# EAGLE design MiiChrono (EAGLE 7.5.0)
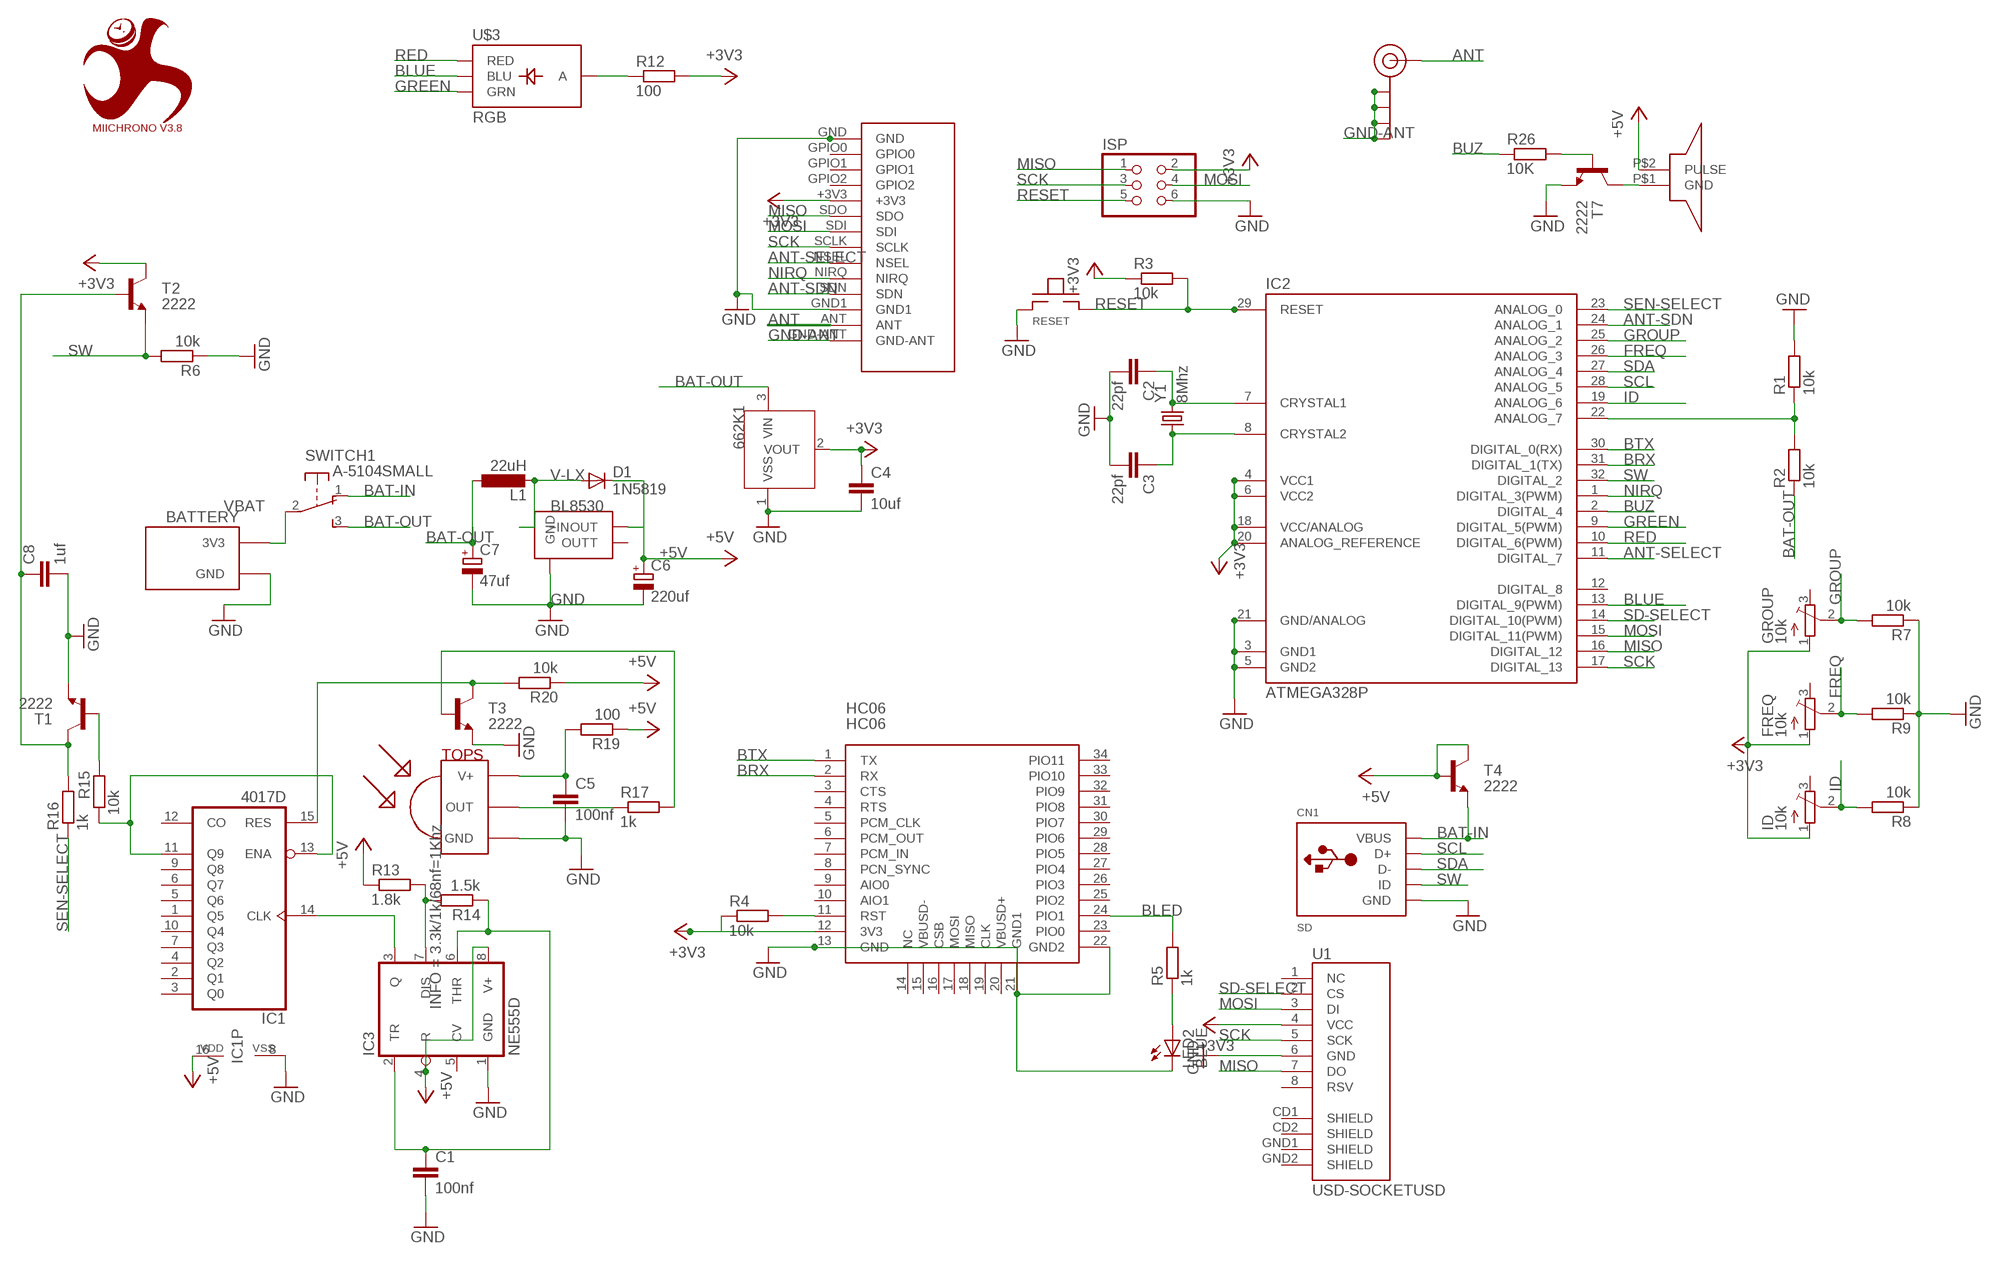
[diagram p0: schematic, sheet 1]

## Parts
662K1  XC6206  [SOT23]
BATTERY  GOPRO3BATTERY  [GOPRO3BATTERY]
BL8530  BL8530  [SOT89]
BUZZER  BUZZER  [BUZZER]
C1  100nf  C-EUC0805  [C0805]
C2  22pf  C-EUC0805  [C0805]
C3  22pf  C-EUC0805  [C0805]
C4  10uf  C-EUC0805  [C0805]
C5  100nf  C-EUC0805  [C0805]
C6  220uf  CPOL-EUCT3528  [CT3528]
C7  47uf  CPOL-EUSMCA  [SMC_A]
C8  1uf  C-EUC0805  [C0805]
CN1  SD  USBMINIB  [USB-MINIB]
D1  1N5819  DIODE-DO214AC  [DO214AC]
FREQ  10k  TRIMPOTTC33X  [TC33X]
GROUP  10k  TRIMPOTTC33X  [TC33X]
HC06  HC06  HC_05  [BLUETOOTH_SMD]
IC1  4017D  [SO16]
IC2  ATMEGA328P  ATMEGA168-AU  [TQFP32-08]
IC3  NE555D  [SO08]
ID  10k  TRIMPOTTC33X  [TC33X]
ISP  PINHD-2X03_2.00  [2X03M]
J$1  SMA_EDGE  [SMA-EDGE]
L1  22uH  L-EUL1812  [L1812]
LED2  BLUE  LEDCHIP-LED0805  [CHIP-LED0805]
R1  10k  R-EU_R0805  [R0805]
R2  10k  R-EU_R0805  [R0805]
R3  10k  R-EU_R0805  [R0805]
R4  10k  R-EU_R0805  [R0805]
R5  1k  R-EU_R0805  [R0805]
R6  10k  R-EU_R0805  [R0805]
R7  10k  R-EU_R0805  [R0805]
R8  10k  R-EU_R0805  [R0805]
R9  10k  R-EU_R0805  [R0805]
R12  100  R-EU_R0805  [R0805]
R13  1.8k  R-EU_R0805  [R0805]
R14  1.5k  R-EU_R0805  [R0805]
R15  10k  R-EU_R0805  [R0805]
R16  1k  R-EU_R0805  [R0805]
R17  1k  R-EU_R0805  [R0805]
R19  100  R-EU_R0805  [R0805]
R20  10k  R-EU_R0805  [R0805]
R26  10K  R-EU_R0805  [R0805]
RESET  TACT  [TACT-TS-1289]
SWITCH  A-5104SMALL  [A-5104-SMALL]
T1  2222  TRANSISTOR_NPNSOT23  [SOT23]
T2  2222  TRANSISTOR_NPNSOT23  [SOT23]
T3  2222  TRANSISTOR_NPNSOT23  [SOT23]
T4  2222  TRANSISTOR_NPNSOT23  [SOT23]
T7  2222  TRANSISTOR_NPNSOT23  [SOT23]
TOPS  TSOP4838  [TSOP18XX]
U1  USD-SOCKETUSD  [USD-SOCKET-PP]
U$1  MIICHRONO V3.8  MIICHRONO  [MIICHRONO]
U$3  RGB  LED-TRICOLOR  [LED-TRICOLOR-SMD]
U$7  SI4432  SPI4432  [SI4432]
Y1  8Mhz  CRYSTALSMD  [HC49UP]

## Nets
+3V3 [supply]: 662K1.2(VOUT) C4.1 FREQ.1(A) GROUP.1(A) HC06.12(3V3) IC2.4(VCC1) IC2.6(VCC2) IC2.18(VCC/ANALOG) IC2.20(ANALOG_REFERENCE) ID.1(A) ISP.2 R3.1 R4.1 R12.2 T2.3(C) U1.4(VCC) U$7.+3V3
+5V [supply]: BL8530.2(OUT) BUZZER.P$2(PULSE) C6.+ D1.C IC1.16(VDD) IC3.4(R) IC3.8(V+) R13.1 R19.1 R20.1 T4.1(B) T4.3(C)
ANT [antenna]: J$1.SIG(SIGNAL) U$7.ANT
ANT-SDN: IC2.24(ANALOG_1) U$7.SDN
ANT-SELECT: IC2.11(DIGITAL_7) U$7.NSEL
BAT-IN [supply]: CN1.VBUS SWITCH.1(1:O) T4.2(E)
BAT-OUT [supply]: 662K1.3(VIN) C7.+ L1.1 R2.1 SWITCH.3(1:S)
BLED: HC06.24(PIO1) R5.2
BLUE: IC2.13(DIGITAL_9(PWM)) U$3.B(BLU)
BRX: HC06.2(RX) IC2.31(DIGITAL_1(TX))
BTX: HC06.1(TX) IC2.30(DIGITAL_0(RX))
BUZ: IC2.2(DIGITAL_4) R26.1
FREQ: FREQ.2(S) IC2.26(ANALOG_3) R9.2
GND [supply]: 662K1.1(VSS) BATTERY.GND BL8530.1(GND) C1.2 C2.2 C3.2 C4.2 C5.2 C6.- C7.- C8.2 CN1.GND HC06.13(GND) HC06.21(GND1) HC06.22(GND2) IC1.8(VSS) IC2.3(GND1) IC2.5(GND2) IC2.21(GND/ANALOG) IC3.1(GND) ISP.6 LED2.C R1.2 R6.1 R7.1 R8.1 R9.1 RESET.TOP-1 T1.2(E) T3.2(E) T7.2(E) TOPS.GND U1.6(GND) U$7.GND U$7.GND1
GND-ANT [antenna]: J$1.GND@0(GND) J$1.GND@1(GND) J$1.GND@2(GND) J$1.GND@3(GND) U$7.GND-ANT
GREEN: IC2.9(DIGITAL_5(PWM)) U$3.G(GRN)
GROUP: GROUP.2(S) IC2.25(ANALOG_2) R7.2
ID: IC2.19(ANALOG_6) ID.2(S) R8.2
MISO: IC2.16(DIGITAL_12) ISP.1 U1.7(DO) U$7.SDO
MOSI: IC2.15(DIGITAL_11(PWM)) ISP.4 U1.3(DI) U$7.SDI
N$1: R17.2 T3.1(B)
N$2: LED2.A R5.1
N$4: C8.1 R16.2 T1.3(C) T2.1(B)
N$5: IC1.11(Q9) IC1.13(ENA) R15.1
N$6: HC06.11(RST) R4.2
N$8: C3.1 IC2.8(CRYSTAL2) Y1.1
N$9: C2.1 IC2.7(CRYSTAL1) Y1.2
N$10: R15.2 T1.1(B)
N$13: R12.1 U$3.A
N$14: C1.1 IC3.2(TR) IC3.6(THR) R14.1
N$16: IC1.14(CLK) IC3.3(Q)
N$17: IC3.7(DIS) R13.2 R14.2
N$20: R17.1 TOPS.OUT
N$21: C5.1 R19.2 TOPS.VCC(V+)
N$23: IC1.15(RES) R20.2 T3.3(C)
N$29: IC2.22(ANALOG_7) R1.1 R2.2
N$33: R26.2 T7.1(B)
N$34: BUZZER.P$1(GND) T7.3(C)
NIRQ: IC2.1(DIGITAL_3(PWM)) U$7.NIRQ
RED: IC2.10(DIGITAL_6(PWM)) U$3.R(RED)
RESET: IC2.29(RESET) ISP.5 R3.2 RESET.BOT-2
SCK: IC2.17(DIGITAL_13) ISP.3 U1.5(SCK) U$7.SCLK
SCL: CN1.D+ IC2.28(ANALOG_5)
SD-SELECT: IC2.14(DIGITAL_10(PWM)) U1.2(CS)
SDA: CN1.D- IC2.27(ANALOG_4)
SEN-SELECT: IC2.23(ANALOG_0) R16.1
SW: CN1.ID IC2.32(DIGITAL_2) R6.2 T2.2(E)
V-LX: BL8530.3(~IN) D1.A L1.2
VBAT [supply]: BATTERY.3V3 SWITCH.2(1:P)
Unconnected: BL8530.4(OUTT) FREQ.3(E) GROUP.3(E) HC06.3(CTS) HC06.4(RTS) HC06.5(PCM_CLK) HC06.6(PCM_OUT) HC06.7(PCM_IN) HC06.8(PCN_SYNC) HC06.9(AIO0) HC06.10(AIO1) HC06.14(NC) HC06.15(VBUSD-) HC06.16(CSB) HC06.17(MOSI) HC06.18(MISO) HC06.19(CLK) HC06.20(VBUSD+) HC06.23(PIO0) HC06.25(PIO2) HC06.26(PIO3) HC06.27(PIO4) HC06.28(PIO5) HC06.29(PIO6) HC06.30(PIO7) HC06.31(PIO8) HC06.32(PIO9) HC06.33(PIO10) HC06.34(PIO11) IC1.1(Q5) IC1.2(Q1) IC1.3(Q0) IC1.4(Q2) IC1.5(Q6) IC1.6(Q7) IC1.7(Q3) IC1.9(Q8) IC1.10(Q4) IC1.12(CO) IC2.12(DIGITAL_8) IC3.5(CV) ID.3(E) SWITCH.MT1(MT) SWITCH.MT2(MT) U1.1(NC) U1.8(RSV) U1.CD1(SHIELD) U1.CD2(SHIELD) U1.GND1(SHIELD) U1.GND2(SHIELD) U$7.GPIO0 U$7.GPIO1 U$7.GPIO2

## Library data of the parts
662K1 = MyLib:XC6206
BATTERY = MyLib:GOPRO3BATTERY
BL8530 = MyLib:BL8530
BUZZER = MyLib:BUZZER
C1-C5 C8 = rcl:C-EU: CAPACITOR, European symbol
C6 C7 = rcl:CPOL-EU: POLARIZED CAPACITOR, European symbol
CN1 = adafruit:USB: USB Connectors USBMINIB - Surface Mount Female Mini-B USB Connector 4UConnector: 06564 By microbuilder.eu Thru-hole RA Female Mini-B USB Connector 4UConnector: 18732 By ladyada.net
D1 = diode:DIODE-: DIODE
FREQ GROUP ID = MyLib:TRIMPOT: SMT trimmer potentiometer part number TC33X http://www.ladyada.net/library/eagle
HC06 = SerialPortBluetooth:HC_05
IC1 = 40xx:4017: COUNTER/DIVIDER
IC2 = Arduino-AVR:ATMEGA168
IC3 = adafruit:*555: TIMER Changed DIP package to have round (not oval) pin pads http://www.ladyada.net/library/pcb/eaglelibrary.html; INFO: 3.3k/1k/68nf=1Khz
ISP = pinhead-2:PINHD-2X03: PIN HEADER
J$1 = SparkFun:SMA_EDGE: SMA Antenna Connector End launch SMA connector. The paste layer has been removed so that the connector can be hand soldered onto the board after reflow.
L1 = rcl:L-EU: INDUCTOR, European symbol
LED2 = adafruit:LED: LED OSRAM: - CHIPLED LG R971, LG N971, LY N971, LG Q971, LY Q971, LO R971, LY R971 LH N974, LH R974 LS Q976, LO Q976, LY Q976 LO Q996 - Hyper CHIPLED LW Q18S LB Q993, LB Q99A, LB R99A - SideLED LS A670, LO A670, LY A670, LG A670, LP A670 LB A673, LV A673, LT A673, LW A673 LH A674 LY A675 LS A676, LA A676, LO A676, LY A676, LW A676 LS A679, LY A679, LG A679 - Hyper Micro SIDELED® LS Y876, LA Y876, LO Y876, LY Y876 LT Y87S - SmartLED LW L88C, LW L88S LB L89C, LB L89S, LG L890 LS L89K, LO L89K, LY L89K LS L896, LA L896, LO L896, LY L896 - TOPLED LS T670, LO T670, LY T670, LG T670, LP T670 LSG T670, LSP T670, LSY T670, LOP T670, LYG T670 LG T671, LOG T671, LSG T671 LB T673, LV T673, LT T673, LW T673 LH T674 LS T676, LA T676, LO T676, LY T676, LB T676, LH T676, LSB T676, LW T676 LB T67C, LV T67C, LT T67C, LS T67K, LO T67K, LY T67K, LW E67C LS E67B, LA E67B, LO E67B, LY E67B, LB E67C, LV E67C, LT E67C LW T67C LS T679, LY T679, LG T679 LS T770, LO T770, LY T770, LG T770, LP T770 LB T773, LV T773, LT T773, LW T773 LH T774 LS E675, LA E675, LY E675, LS T675 LS T776, LA T776, LO T776, LY T776, LB T776 LHGB T686 LT T68C, LB T68C - Hyper Mini TOPLED® LB M676 - Mini TOPLED Santana® LG M470 LS M47K, LO M47K, LY M47K Source: http://www.osram.convergy.de/
R1-R9 R13-R17 R19 R20 = rcl:R-EU_: RESISTOR, European symbol
R12 = rcl:R-EU_: RESISTOR, European symbol; NOTE: WAS 68
R26 = rcl:R-EU_: RESISTOR, European symbol; NOTE: WAS 120
RESET = MyLib:TACT
SWITCH = MyLib:A-5104: E-Switch right-angle slide SPDT Ebay and taydaElectronics A-5014
T1-T4 T7 = SparkFun:TRANSISTOR_NPN: Transistor NPN BJT configuration in SOT23 package. MMBT2222 is the common NPN we use. Double check BCE configuration again layout.
TOPS = tsop:TSOP4838: IR Receiver and Demodulator
U1 = MyLib:USD-SOCKET: microSD Socket Part found on EBay
U$1 = MyLib:MIICHRONO
U$3 = MyLib:LED-TRICOLOR: Tri-Color LED SMD Proven layout and schematic for triple color LED in SMD package - common anode. Spark Fun Electronics SKU : COM-07844
U$7 = MyLib:SPI4432
Y1 = SparkFun:CRYSTAL: Crystals Various standard crystals. Proven footprints. Spark Fun Electronics SKU : COM-00534

## Net classes
0 default: width 0.203 mm
1 supply: width 0.254 mm
2 antenna: width 0.254 mm

## Board
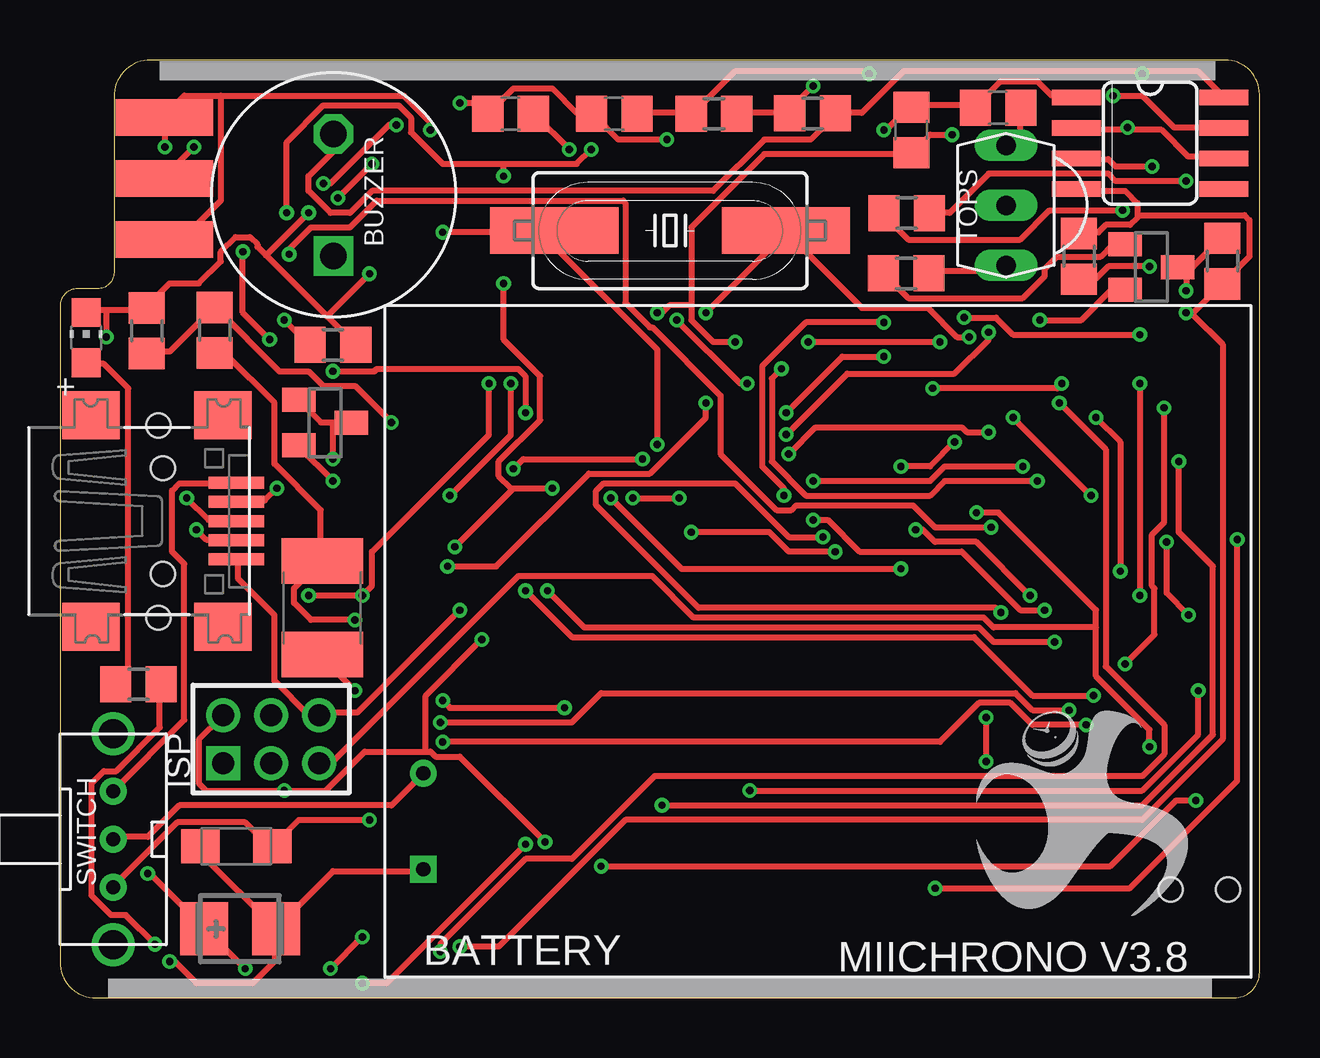
[diagram p1: board, top side]
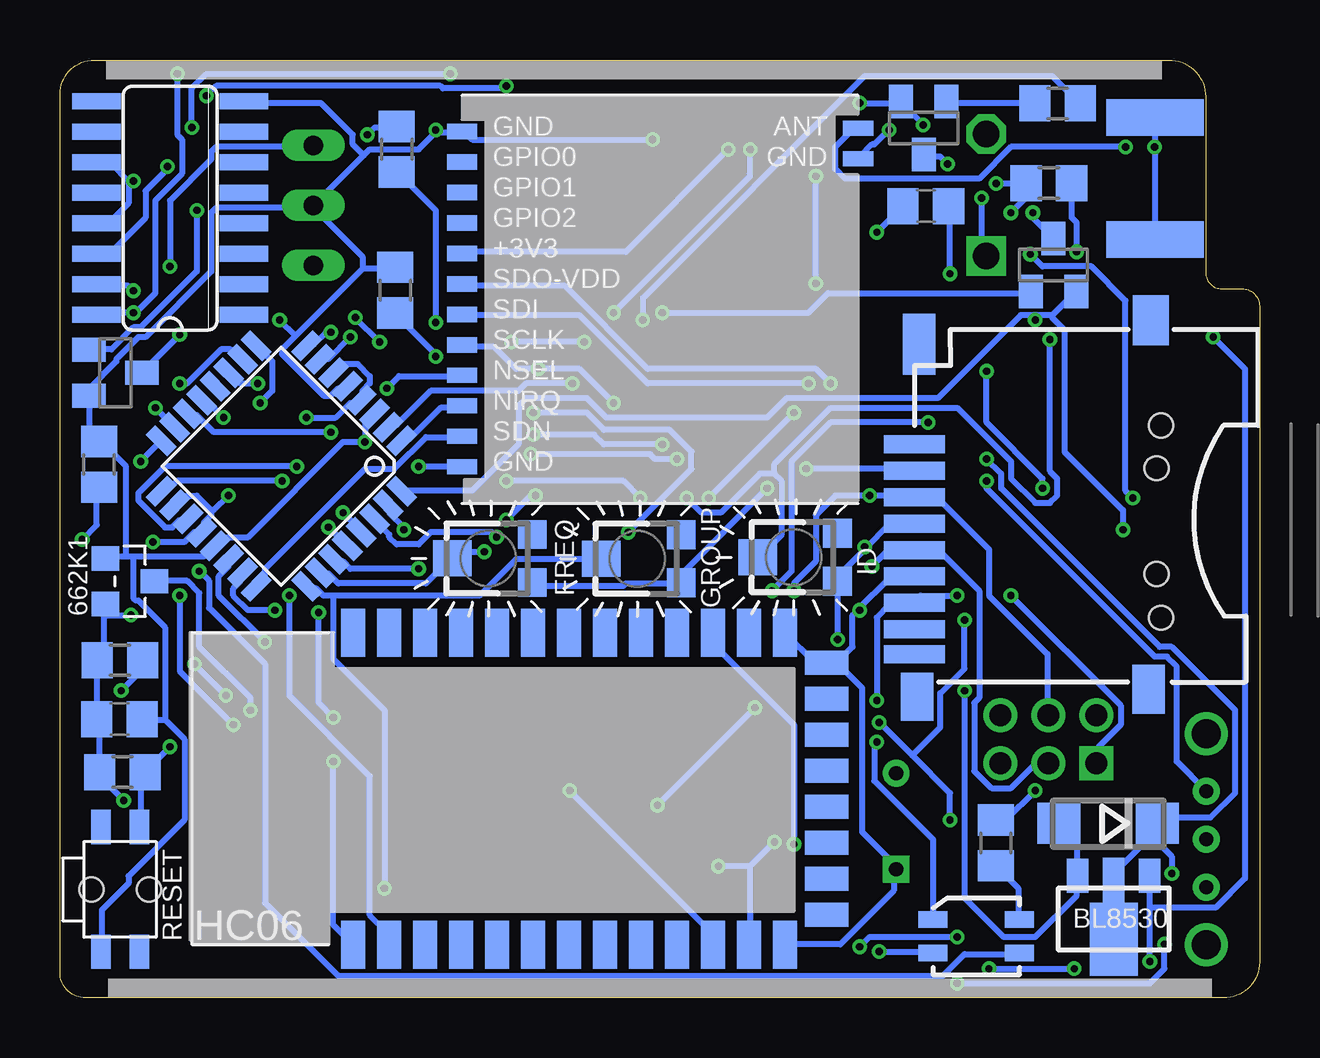
[diagram p2: board, bottom side, seen from below]

Size 50 x 39.08 mm. Coordinates in mm from the lower left corner, seen from the top.
Outline: 50,1.06 50,37.65 arc90 48.57,39.08 3.78,39.08 arc90 2.25,37.55 2.25,30.22 arc-90 1.58,29.55 0.72,29.55 arc90 0,28.82 0,1.5 arc90 1.5,0 48.94,0 arc90 50,1.06
Copper layers (1*16): Top 0.035mm / dielectric 1.5mm / Bottom 0.035mm
Design rules "SierkSeed *": minimum track width 10mil, minimum drill 12mil, track to track 6mil, track to pad 6mil, pad to pad 6mil, via to via 6mil, smd to smd 0mil, copper to edge 10mil, drill to drill 10mil, minimum pad ring 10mil, minimum via ring 6mil, stop-mask expansion 2mil, vias tented up to drill 100mil, thermal gap 10mil

### Footprints (pad centres in the part's own frame; a part is rotated, then mirrored left to right if it is on the bottom)
SOT23 = smd 1.016 x 1.143: 1 -0.95,-1.016; 2 0.95,-1.016; 3 0,1.016
GOPRO3BATTERY = drill 0.6: 3V3 0,4 | drill 0.6 square: GND 0,0
SOT89 = smd 0.889 x 1.397: 1 -1.5,-1.8; 3 1.5,-1.8 | smd 0.889 x 1.905: 2 0,-1.6 | smd 2 x 3.048: 4 0,0.838
BUZZER = drill 1.1 square: P$1 0,0 | drill 1.1 octagon: P$2 5.08,0
C0805 = smd 1.3 x 1.5: 1 -0.95,0; 2 0.95,0
CT3528 = smd 2 x 2.2: + -1.5,0; - 1.5,0
SMC_A = smd 1.6 x 1.4: + -1.5,0; - 1.5,0
USB-MINIB = smd 0.5 x 2.308: D+ 0,4.064; D- -0.8,4.064; GND 1.6,4.064; ID 0.8,4.064; VBUS -1.6,4.064 | smd 2 x 2.4: GND1 -4.4,-2; GND2 -4.4,3.5; GND3 4.4,3.5; GND4 4.4,-2 | hole 1: -2.2,1; 2.2,1
DO214AC = smd 1.8 x 1.7: A 2.05,0; C -2.05,0
TC33X = smd 1.2 x 1.2: 1 -1,-1.825; 3 1,-1.825 | smd 1.5 x 1.6: 2 0,1.5
BLUETOOTH_SMD = smd 2 x 1: 1 0,0; 2 0,-1.5; 3 0,-3; 4 0,-4.5; 5 0,-6; 6 0,-7.5; 7 0,-9; 8 0,-10.5; 9 0,-12; 10 0,-13.5; 11 0,-15; 12 0,-16.5; 13 0,-18; 22 13,-18; 23 13,-16.5; 24 13,-15; 25 13,-13.5; 26 13,-12; 27 13,-10.5; 28 13,-9; 29 13,-7.5; 30 13,-6; 31 13,-4.5; 32 13,-3; 33 13,-1.5; 34 13,0 | smd 1 x 1.8: 14 1.25,-19.75; 15 2.75,-19.75; 16 4.25,-19.75; 17 5.75,-19.75; 18 7.25,-19.75; 19 8.75,-19.75; 20 10.25,-19.75; 21 11.75,-19.75
SO16 = smd 0.66 x 2.032: 1 -4.445,-3.073; 2 -3.175,-3.073; 3 -1.905,-3.073; 4 -0.635,-3.073; 5 0.635,-3.073; 6 1.905,-3.073; 7 3.175,-3.073; 8 4.445,-3.073; 9 4.445,3.073; 10 3.175,3.073; 11 1.905,3.073; 12 0.635,3.073; 13 -0.635,3.073; 14 -1.905,3.073; 15 -3.175,3.073; 16 -4.445,3.073
TQFP32-08 = smd 1.27 x 0.559: 1 -4.293,2.8; 2 -4.293,2; 3 -4.293,1.2; 4 -4.293,0.4; 5 -4.293,-0.4; 6 -4.293,-1.2; 7 -4.293,-2; 8 -4.293,-2.8; 17 4.293,-2.8; 18 4.293,-2; 19 4.293,-1.2; 20 4.293,-0.4; 21 4.293,0.4; 22 4.293,1.2; 23 4.293,2; 24 4.293,2.8 | smd 0.559 x 1.27: 9 -2.8,-4.293; 10 -2,-4.293; 11 -1.2,-4.293; 12 -0.4,-4.293; 13 0.4,-4.293; 14 1.2,-4.293; 15 2,-4.293; 16 2.8,-4.293; 25 2.8,4.293; 26 2,4.293; 27 1.2,4.293; 28 0.4,4.293; 29 -0.4,4.293; 30 -1.2,4.293; 31 -2,4.293; 32 -2.8,4.293
SO08 = smd 0.66 x 2.032: 1 -1.905,-3.073; 2 -0.635,-3.073; 3 0.635,-3.073; 4 1.905,-3.073; 5 1.905,3.073; 6 0.635,3.073; 7 -0.635,3.073; 8 -1.905,3.073
2X03M = drill 0.914 square: 1 -2,-1 | drill 0.914: 2 -2,1; 3 0,-1; 4 0,1; 5 2,-1; 6 2,1
SMA-EDGE = smd 1.524 x 4.064: GND@0 0,0; GND@1 5.08,0; SIG 2.54,0 | smd 1.524 x 4.064 bottom: GND@2 0,0; GND@3 5.08,0
L1812 = smd 1.9 x 3.4: 1 -1.95,0; 2 1.95,0
CHIP-LED0805 = smd 1.2 x 1.2: A 0,-1.05; C 0,1.05
R0805 = smd 1.3 x 1.5: 1 -0.95,0; 2 0.95,0
TACT-TS-1289 = smd 1.422 x 0.813: BOT-1 -2.6,-0.8; BOT-2 2.6,-0.8; TOP-1 -2.6,0.8; TOP-2 2.6,0.8 | hole 1: 0,1.2; 0,-1.2
A-5104-SMALL = drill 0.6: 1 -2,0; 2 0,0; 3 2,0 | drill 1.2: MT1 -4.4,0; MT2 4.4,0
SOT23' = smd 1 x 1.4: 1 -0.95,-1.1; 2 0.95,-1.1; 3 0,1.1
TSOP18XX = drill 0.813 long: GND -0.001,-0.027; OUT -2.501,-0.027; VCC 2.499,-0.027
USD-SOCKET-PP = smd 0.75 x 2.54: 1 3.2,17.018; 2 2.1,17.018; 3 1,17.018; 4 -0.1,17.018; 5 -1.2,17.018; 6 -2.3,17.018; 7 -3.4,17.018; 8 -4.5,17.018; CD1 -5.55,17.018 | smd 2.046 x 1.35: CD2 -6.995,7.25 | smd 2.008 x 1.35: GND1 -7.313,16.905 | smd 2.07 x 1.5: GND2 8.379,7.165 | smd 2.54 x 1.35: P$1 7.38,16.82 | hole 1: 3.99,6.73; -4.02,6.73
LED-TRICOLOR-SMD = smd 0.7 x 1.2: A 0.7,-1.8; B -0.7,-1.8; G -0.7,1.8; R 0.7,1.8
SI4432 = smd 0.635 x 1.27: +3V3 6.59,0; ANT 1.37,16.51; GND 1.51,0; GND1 15.48,0; GND-ANT 2.64,16.51; GPIO0 2.78,0; GPIO1 4.05,0; GPIO2 5.32,0; NIRQ 12.94,0; NSEL 11.67,0; SCLK 10.4,0; SDI 9.13,0; SDN 14.21,0; SDO 7.86,0
HC49UP = smd 5.334 x 1.93: 1 -4.826,0; 2 4.826,0

### Placement (x,y rotation side)
662K1  47.08,17.36 270 bottom
BATTERY  15.14,5.36 0 top
BL8530  6.08,3.29 180 bottom
BUZZER  11.4,30.92 90 top
C1  23.1,36.84 180 top
C2  18.78,36.84 180 top
C3  13.91,32.99 0 bottom
C4  47.52,11.62 0 bottom
C5  39.1,37.09 180 top
C6  7.5,2.88 0 top
C7  7.35,6.32 180 top
C8  35.48,36.16 90 top
CN1  3.29,19.87 270 top
D1  6.31,7.28 180 bottom
FREQ  32.14,18.31 90 bottom
GROUP  25.93,18.3 90 bottom
HC06  37.79,2.22 90 bottom
IC1  45.41,32.91 90 bottom
IC2  40.77,22.16 225 bottom
IC3  45.44,35.61 270 top
ID  19.42,18.36 90 bottom
ISP  8.8,10.78 0 top
J$1  4.35,31.6 90 top
L1  10.93,16.26 270 top
LED2  1.09,27.51 0 top
R1  3.62,27.8 90 top
R2  6.45,27.82 90 top
R3  47.4,9.41 0 bottom
R4  47.5,14.07 0 bottom
R5  3.27,13.07 0 top
R6  11.38,27.21 180 top
R7  48.37,22.23 270 bottom
R8  8.78,33.95 0 bottom
R9  36.03,29.49 270 bottom
R12  10.99,6.46 90 bottom
R13  31.37,36.86 180 top
R14  27.26,36.84 0 top
R15  35.29,32.7 180 top
R16  35.96,35.36 90 bottom
R17  35.27,30.19 180 top
R19  42.47,30.9 270 top
R20  48.45,30.7 90 top
R26  8.42,37.27 180 bottom
RESET  47.49,4.52 90 bottom
SWITCH  2.22,6.61 270 top
T1  2222  [SOT23']  47.69,26.05 270 bottom
T2  2222  [SOT23']  8.59,30.54 0 bottom
T3  2222  [SOT23']  45.49,30.45 270 top
T4  2222  [SOT23']  11.05,23.97 270 top
T7  2222  [SOT23']  14,36.25 180 bottom
TOPS  39.41,33.02 90 top
U1  -2.63,19.86 90 bottom
U$1  38.19,3.42 0 top
U$3  11.81,2.57 90 bottom
U$7  33.24,37.61 270 bottom
Y1  25.43,31.97 0 top

### Tracks (layer width: path | path; a pad name or v marks a point on that pad's centre or on a via)
+3V3  (via drill 0.3)
  Top 0.254: v22.15,35.36 21.54,34.75 18.49,34.75 | 18.49,34.75 15.95,34.75 14.63,36.07 14.63,36.68 14.12,37.19 10.97,37.19 9.45,35.66 v9.45,32.72 | v46.13,19 46.13,16.87 v47.04,15.95 | v42.98,20.93 v39.73,24.18 | 18.9,21.23 v20.52,21.23 | v16.46,18.8 18.9,21.23 | ISP.2 6.71,11.68 5.79,10.77 5.79,8.94 6.1,8.64 v9.35,8.64 11.07,8.64 12.7,10.26 15.24,10.26 | v20.22,6.5 16.66,10.06 15.65,10.06 15.44,10.26 15.24,10.26 | v17.58,14.94 15.24,12.6 15.24,10.26 | v47.35,8.23 46.53,8.23 43.79,5.49 v22.55,5.49 | v18.49,34.24 18.49,34.75 | v18.49,29.77 18.49,27.43 20.02,25.91 20.02,24.08 18.29,22.35 18.29,21.74 18.8,21.23 18.9,21.23
  Bottom 0.254: v22.15,35.36 26.42,31.09 33.22,31.09 U$7.+3V3 | v9.45,32.72 9.45,32.51 8.64,31.7 T2.3 | IC2.6 38.51,26.11 38.2,26.42 37.59,26.42 37.08,25.91 37.08,25.6 37.39,25.3 37.39,24.99 IC2.4 37.49,24.79 37.9,24.79 38.51,24.18 v39.73,24.18 | 43.69,20.32 43.69,20.12 43.99,19.81 43.99,19.51 IC2.20 44.2,19.41 44.4,19.41 44.81,19 v46.13,19 | 43.69,20.32 44.3,20.93 44.91,20.93 45.21,20.62 IC2.18 | v47.04,15.95 48.06,15.95 662K1.2 48.16,16.36 48.16,14.33 48.36,14.12 R4.1 48.46,14.02 48.46,11.68 C4.1 48.46,11.58 48.36,11.48 48.36,9.45 R3.1 48.26,9.35 48.26,9.14 v47.35,8.23 | v42.98,20.93 43.59,20.32 43.69,20.32 | FREQ.1 30.28,17.27 30.18,17.17 26.52,17.17 26.42,17.27 24.18,17.27 GROUP.1 24.08,17.37 24.08,17.68 v20.52,21.23 | 16.41,18.75 15.44,19.71 14.43,19.71 U1.4 | 16.41,18.75 17.58,17.58 17.58,17.37 ID.1 17.58,17.27 v17.58,14.94 | v16.46,18.8 16.41,18.75 | v9.35,8.64 10.57,7.42 10.97,7.42 R12.2 | 21.23,5.49 21.23,2.23 HC06.12 | v20.22,6.5 21.23,5.49 | 21.23,5.49 v22.55,5.49 | v18.49,29.77 v18.49,34.24
+5V  (via drill 0.3)
  Top 0.254: 11.38,23.98 10.87,23.98 9.96,24.89 T4.1 | 11.38,23.98 12.09,23.98 T4.3 | v3.66,5.18 3.76,5.18 5.99,2.95 C6.+ 6.1,2.85 v7.72,1.22 | v11.38,22.45 11.38,23.98 | 44.91,32.61 44.91,33.12 44.4,33.63 42.37,33.63 IC3.4 | 44.91,32.61 44.91,32.51 44.6,32.21 43.59,32.21 43.28,31.9 42.57,31.9 R19.1 | 44.91,32.61 49.38,32.61 49.58,32.41 49.58,30.89 48.46,29.77 R20.1 48.36,29.67 47.24,28.55 | 47.24,28.55 v46.94,28.55 | 45.11,38.61 47.45,38.61 48.46,37.59 IC3.8 | 45.11,38.61 35.15,38.61 33.43,36.88 32.41,36.88 R13.1 32.31,36.78 31.29,35.76 29.36,35.76 27.23,33.63 13.01,33.63 12.09,32.72 11.28,32.72 10.36,33.63 10.36,34.24 11.38,35.26 11.38,35.97 BUZZER.P$2 | v45.11,38.51 45.11,38.61 | v12.6,2.54 v11.28,1.22 | v16.66,2.13 18.29,2.13 23.57,7.42 45.11,7.42 48.46,10.77 48.46,27.23 47.24,28.45 47.24,28.55
  Bottom 0.254: D1.C 4.27,7.21 4.27,7.01 5.99,5.28 5.99,4.98 BL8530.2 | v3.66,5.18 3.66,5.89 4.47,6.71 D1.C | v11.38,22.45 10.77,21.84 10.77,21.23 4.17,14.63 3.66,14.63 1.02,11.99 1.02,8.53 2.03,7.52 3.96,7.52 4.17,7.32 D1.C | IC1.16 48.46,28.55 v46.94,28.55 46.84,28.55 46.02,29.36 46.02,33.22 44.91,34.34 44.91,35.76 45.11,35.97 v45.11,38.51 | v11.28,1.22 v7.72,1.22 | v12.6,2.54 16.26,2.54 v16.66,2.13
ANT  (via drill 0.3)
  Top 0.254: v5.59,35.46 4.37,34.24 J$1.SIG
  Bottom 0.254: v5.59,35.46 10.36,35.46 11.68,34.14 17.27,34.14 17.68,34.54 17.68,35.46 16.97,36.17 16.76,36.17 U$7.ANT
ANT-SDN
  Bottom 0.254: U$7.SDN 33.33,23.37 34.75,23.37 36.07,22.05 37.29,22.05 41.45,17.88 41.45,17.48 41.76,17.17 IC2.24
ANT-SELECT  (via drill 0.3)
  Top 0.254: v36.37,25.4 41.55,25.4 v41.76,25.6
  Bottom 0.254: v36.37,25.4 35.87,25.91 33.33,25.91 U$7.NSEL | v41.76,25.6 42.47,25.6 42.88,26.01 IC2.11
BAT-IN  (via drill 0.3)
  Top 0.254: v11.38,21.54 9.96,22.96 T4.2 | CN1.VBUS 7.32,21.44 4.98,21.44 4.67,21.13 4.67,18.59 5.18,18.09 5.18,11.58 2.23,8.64 SWITCH.1
  Bottom 0.254: v11.38,21.54 11.38,21.23 4.37,14.22 3.86,14.22 3.45,13.82 3.45,9.86 2.23,8.64 SWITCH.1
BAT-OUT  (via drill 0.3)
  Top 0.254: R2.1 6.5,26.82 6.91,26.82 8.94,24.79 8.94,22.25 10.87,20.32 10.87,18.29 L1.1 10.87,18.19 9.75,17.07 9.75,16.46 10.46,15.75 v12.29,15.75 | v42.06,11.99 40.54,11.99 39.83,12.7 22.55,12.7 21.34,11.48 v15.85,11.48 | v12.9,7.42 9.96,7.42 8.94,6.4 C7.+ 8.74,6.3 7.72,7.32 4.88,7.32 2.23,4.67 SWITCH.3
  Bottom 0.254: v42.06,11.99 42.06,12.5 44.2,14.63 44.2,16.87 44.7,17.37 46.02,17.37 662K1.3 | 14.48,10.11 12.9,8.53 v12.9,7.42 | 14.48,10.11 v15.85,11.48 | v12.29,15.75 12.29,13.72 13.31,12.7 13.31,11.28 14.48,10.11
BLED  (via drill 0.3)
  Top 0.254: v3.96,2.23 2.74,3.45 2.13,3.45 1.32,4.27 1.32,8.94 1.83,9.45 2.34,9.45 4.17,11.28 4.17,13.01 R5.2 | v12.6,0.61 13.61,0.61 v19.41,6.4
  Bottom 0.254: v3.96,2.23 3.96,1.22 4.57,0.61 v12.6,0.61 | v19.41,6.4 19.41,11.38 22.76,14.73 22.76,15.14 HC06.24
BLUE  (via drill 0.3)
  Top 0.254: v44.2,17.78 44.2,23.16 v43.18,24.18
  Bottom 0.254: v44.2,17.78 43.79,17.37 43.79,16.26 41.45,13.92 41.45,3.96 38.41,0.91 13.21,0.91 12.29,1.83 10.06,1.83 U$3.B | v43.18,24.18 43.99,24.99 IC2.13
BRX  (via drill 0.3)
  Top 0.254: v35.66,19.51 35.97,19.51 36.47,19 38.2,19 v40.44,16.76
  Bottom 0.254: v35.66,19.51 35.66,19.61 36.27,20.22 36.27,20.52 IC2.31 | v40.44,16.76 40.44,12.6 37.08,9.25 37.08,3.45 36.37,2.74 36.37,2.23 HC06.2
BTX  (via drill 0.3)
  Top 0.254: v31.8,19.2 30.38,19.2 28.14,21.44 22.66,21.44 22.35,21.13 22.35,20.52 26.62,16.26 39.01,16.26 v39.22,16.05 | v38.61,9.86 v38.61,11.68
  Bottom 0.254: v31.8,19.2 32,19.41 34.54,19.41 35.05,18.9 35.97,18.9 36.27,19.2 36.27,19.3 36.88,19.91 IC2.30 | v39.22,16.05 39.22,12.29 v38.61,11.68 | v38.61,9.86 38.61,3.05 37.8,2.23 HC06.1
BUZ  (via drill 0.3)
  Top 0.254: v28.65,25.6 28.35,25.6 v25.7,28.25
  Bottom 0.254: v28.65,25.6 30.58,25.6 30.89,25.3 34.54,25.3 35.97,23.88 36.27,23.88 IC2.2 | v25.7,28.25 25.7,29.16 16.46,38.41 8.64,38.41 7.52,37.29 R26.1
FREQ  (via drill 0.3)
  Top 0.254: v34.34,26.72 32.61,26.72 v30.28,24.38 | v26.31,19.41 29.57,19.41 30.38,18.59 v32.31,18.59
  Bottom 0.254: IC2.26 39.12,17.68 38.81,17.68 38.41,17.27 34.75,17.27 33.73,18.29 FREQ.2 33.53,18.29 33.22,18.59 v32.31,18.59 | v34.34,26.72 34.34,26.82 35.97,28.45 R9.2 | v30.28,24.38 28.04,24.38 27.33,23.67 24.59,23.67 23.67,22.76 23.67,22.05 v26.31,19.41
GND  (via drill 0.3)
  Top 0.254: v35.05,22.15 36.27,22.15 v37.29,23.16 | CN1.GND 7.42,18.19 7.42,17.48 8.94,15.95 8.94,13.21 10.36,11.79 10.77,11.79 ISP.6 10.87,11.89 12.39,11.89 v16.66,16.15 | v4.57,1.52 4.78,1.52 5.69,0.61 8.03,0.61 8.94,1.52 8.94,2.85 C6.- | C7.- 5.89,6.3 5.89,5.99 8.94,2.95 C6.- | BATTERY.GND 15.14,5.28 11.38,5.28 9.04,2.95 C6.- | 1.93,28.65 3.56,28.65 R1.2 3.66,28.85 4.57,29.77 5.79,29.77 6.71,30.68 6.71,31.09 7.32,31.7 7.92,31.7 8.23,31.39 8.23,31.29 8.59,30.94 | 1.93,28.65 1.12,28.65 LED2.C | 8.59,30.94 11.12,28.4 | 11.12,28.4 12.29,27.23 R6.1 | 11.12,28.4 v12.9,30.18 | 8.59,30.94 v10.36,32.72 | v40.84,28.25 42.57,28.25 43.79,29.46 44.3,29.46 T3.2 | IC3.1 42.27,37.59 41.35,37.59 40.74,38.2 39.22,38.2 38.2,37.19 C5.2 38.1,37.19 35.56,37.19 C8.2 35.36,37.08 34.44,36.17 v34.34,36.17 | v16.66,37.29 17.37,37.29 17.78,36.88 C2.2 17.88,36.88 18.9,37.9 20.52,37.9 21.54,36.88 22.15,36.88 C1.2 22.25,36.78 23.27,35.76 v25.3,35.76 | v10.97,33.93 11.28,33.93 13.72,36.37 v14.02,36.37 | 1.93,28.65 v1.93,27.53
  Bottom 0.254: 45.62,11.58 44.81,10.77 44.81,7.42 47.14,5.08 47.14,4.78 48.26,3.66 48.26,1.93 RESET.TOP-1 | 45.62,11.58 46.53,11.58 C4.2 | v35.05,22.15 33.33,22.15 U$7.GND1 | IC2.3 36.98,24.28 37.29,23.98 v37.29,23.16 38.2,23.16 42.16,19.2 43.18,19.2 43.48,18.9 IC2.21 43.59,18.8 43.99,18.39 46.94,18.39 | 46.94,18.39 47.24,18.39 | 47.24,18.39 48.06,18.39 662K1.1 | 47.24,18.39 47.24,22.15 48.26,23.16 R7.1 48.46,23.27 48.77,23.57 48.77,25.09 T1.2 48.77,25.2 48.77,25.4 47.65,26.52 47.65,26.62 46.74,27.53 46.43,27.53 43.69,30.28 43.69,32.72 43.48,32.92 39.52,32.92 TOPS.GND | 45.62,11.58 45.62,15.44 46.74,16.56 46.84,16.56 46.94,16.66 46.94,18.39 | HC06.21 18.09,14.02 18.59,14.02 19.71,15.14 HC06.22 | 16.71,16.2 16.97,15.95 16.97,14.63 17.58,14.02 17.98,14.02 HC06.21 | 16.71,16.2 15.44,17.48 14.43,17.48 U1.6 | HC06.13 19.71,2.23 17.48,2.23 15.24,4.47 15.24,5.28 BATTERY.GND 15.14,5.49 16.56,6.91 16.56,12.9 17.58,13.92 HC06.21 | v4.57,1.52 4.57,3.76 | 4.57,3.76 BL8530.1 | v16.66,16.15 16.71,16.2 | v12.9,30.18 12.9,32.92 C3.2 | v10.36,32.72 9.75,33.33 9.75,33.93 R8.1 9.86,33.93 v10.97,33.93 | 37.39,30.38 40.18,27.58 | 40.18,27.58 40.74,27.03 40.74,26.82 39.01,25.09 38.71,25.09 38.41,25.4 38.1,25.4 IC2.5 | 37.39,30.38 36.07,30.38 R9.1 | 40.18,27.58 v40.84,28.25 | v16.66,37.29 15.04,37.29 T7.2 14.94,37.29 v14.02,36.37 | 34.34,36.07 33.33,36.07 U$7.GND 33.12,36.07 32.82,35.76 v25.3,35.76 | 34.34,36.07 35.05,35.36 37.08,35.36 37.34,35.1 | 37.34,35.1 39.42,33.02 TOPS.GND | 37.34,35.1 37.8,35.56 37.8,35.97 39.12,37.29 42.27,37.29 IC1.8 | v34.34,36.17 34.34,36.07 | 37.39,30.38 37.39,30.89 39.42,32.92 TOPS.GND
  Bottom 0.254: 4.57,3.76 1.83,3.76 0.61,4.98 0.61,26.21 v1.93,27.53
GND-ANT  (via drill 0.3)
  Top 0.254: v15.44,36.17 15.44,36.47 14.33,37.59 6.71,37.59 | 6.71,37.59 5.18,37.59 4.37,36.78 J$1.GND@3 4.37,36.58 v4.37,35.46 | 6.71,37.59 6.71,33.22 5.18,31.7 4.37,31.7 J$1.GND@2
  Bottom 0.254: J$1.GND@2 4.37,31.7 v4.37,35.46 4.37,36.68 J$1.GND@3 | v15.44,36.17 16.05,35.56 16.15,35.56 16.66,35.05 U$7.GND-ANT
GREEN  (via drill 0.3)
  Top 0.254: v15.85,1.93 15.85,2.23 19.41,5.79 21.34,5.79 24.79,9.25 45.11,9.25 46.02,10.16 46.02,11.38 43.59,13.82 43.59,22.86 v41.66,24.79
  Bottom 0.254: v15.85,1.93 13.61,1.93 U$3.G | v41.66,24.79 41.15,25.3 41.15,26.52 41.76,27.13 IC2.9
GROUP  (via drill 0.3)
  Top 0.254: v49.07,19.1 49.07,9.04 44.6,4.57 v36.47,4.57
  Bottom 0.254: 38.61,16.76 32.51,16.76 30.99,18.29 27.43,18.29 GROUP.2 | 38.61,16.76 39.01,16.76 39.32,17.07 39.62,17.07 IC2.25 | v49.07,19.1 48.46,19.71 48.46,21.23 R7.2 | v36.47,4.57 36.47,11.99 38.61,14.12 38.61,16.76
ID  (via drill 0.3)
  Top 0.254: v40.13,22.15 36.88,22.15 36.27,21.54 v31.39,21.54 | v23.88,20.83 v25.81,20.83 | v7.62,31.09 7.62,28.55 v8.74,27.43
  Bottom 0.254: v40.13,22.15 45.62,22.15 46.74,21.03 46.74,20.73 45.62,19.61 45.31,19.61 45.01,19.91 44.7,19.91 IC2.19 | v31.39,21.54 26.52,21.54 v25.81,20.83 | v23.88,20.83 23.27,20.22 22.45,20.22 20.83,21.84 20.22,21.84 | 20.22,21.84 19.91,21.54 19.91,19.3 20.83,18.39 ID.2 | v7.62,31.09 7.62,32.31 7.82,32.51 7.82,33.93 R8.2 | v8.74,27.43 8.74,21.95 8.43,21.64 8.43,20.93 8.74,20.62 9.35,20.62 10.36,21.64 10.36,22.35 12.6,24.59 17.88,24.59 20.22,22.25 20.22,21.84
MISO  (via drill 0.3)
  Top 0.254: v17.88,25.6 17.88,23.47 13.01,18.59 13.01,17.17 v12.6,16.76 v10.36,16.76 | v46.63,22.35 46.63,19.41 48.06,17.98 48.06,10.97 45.11,8.03 v25.09,8.03 | v21.03,12.09 16.26,12.09 v15.95,12.39
  Bottom 0.254: v17.88,25.6 18.49,26.21 25.5,26.21 28.96,29.67 33.22,29.67 U$7.SDO | v12.6,16.76 14.12,16.76 14.33,16.56 U1.7 14.43,16.36 15.44,16.36 15.95,15.85 v15.95,12.39 | v46.63,22.35 45.82,23.16 IC2.16 | v21.03,12.09 v25.09,8.03 | v10.36,16.76 5.79,12.19 5.79,11.38 6.71,10.46 6.71,9.86 ISP.1
MOSI  (via drill 0.3)
  Top 0.254: v18.8,25.6 18.8,23.47 v16.26,20.93 | v46.02,24.59 46.02,19.81 45.52,19.3 45.52,17.17 45.62,17.07 45.62,15.14 v44.4,13.92 | v43.08,12.6 40.54,12.6 38.1,15.04 21.34,15.04 v19.41,16.97
  Bottom 0.254: v18.8,25.6 25.5,25.6 28.35,28.45 33.22,28.45 U$7.SDI | v46.02,24.59 45.31,23.88 IC2.15 | v43.08,12.6 v44.4,13.92 | v19.41,16.97 19.41,17.27 18.49,18.19 18.49,20.12 17.68,20.93 v16.26,20.93 14.43,20.93 U1.3 14.33,20.83 13.41,20.83 11.28,18.69 11.28,16.76 8.84,14.33 8.84,11.79 ISP.4
N$1
  Top 0.254: T3.1 44.3,31.39 43.89,31.39 43.38,30.89 41.55,30.89 41.05,30.38 41.05,30.07 40.13,29.16 35.36,29.16 34.34,30.18 R17.2
N$2
  Top 0.254: LED2.A 1.12,26.42 1.83,26.42 2.85,25.4 2.85,13.61 2.34,13.11 R5.1
N$4  (via drill 0.3)
  Top 0.254: v45.01,27.64 39.73,27.64 39.01,28.35 v37.69,28.35 | v31.19,27.33 v36.68,27.33 | v28.14,27.33 27.23,27.33 26.31,28.25 26.31,28.85 | 26.31,28.85 26.31,32.11 29.36,35.15 35.46,35.15 C8.1 35.56,35.26 36.27,35.97 v37.19,35.97 | v24.89,28.55 25.09,28.55 25.4,28.85 26.31,28.85
  Bottom 0.254: v45.01,27.64 46.53,26.11 T1.3 | v36.68,27.33 v37.69,28.35 | v28.14,27.33 v31.19,27.33 | v24.89,28.55 18.8,28.55 17.98,29.36 9.55,29.36 T2.1 | v37.19,35.97 36.88,36.27 35.97,36.27 R16.2
N$5  (via drill 0.3)
  Top 0.254: v46.94,34.04 43.99,34.04 43.69,34.34 38.71,34.34 37.08,32.72 36.27,32.72 R15.1
  Bottom 0.254: IC1.11 48.46,34.75 47.85,34.75 47.14,34.04 v46.94,34.04 47.14,33.93 47.14,33.12 47.95,32.31 48.46,32.31 IC1.13
N$6  (via drill 0.3)
  Top 0.254: v47.45,12.8 47.45,10.97 45.11,8.64 v28.75,8.64
  Bottom 0.254: v47.45,12.8 46.63,13.61 46.63,14.02 R4.2 | v28.75,8.64 22.86,2.74 22.86,2.23 HC06.11
N$8  (via drill 0.3)
  Top 0.254: v38.71,27.74 38.71,27.43 37.29,26.01 32.82,26.01 v30.28,23.47 | v24.89,23.06 24.89,27.03 20.62,31.29 20.62,31.9 Y1.1 20.52,31.9 v15.95,31.9
  Bottom 0.254: v38.71,27.74 38.91,27.74 39.42,27.23 39.62,27.23 IC2.8 | v30.28,23.47 27.74,23.47 27.33,23.06 v24.89,23.06 | v15.95,31.9 14.94,32.92 C3.1
N$9  (via drill 0.3)
  Top 0.254: v37.9,27.53 37.39,27.53 36.17,28.75 33.43,28.75 30.28,31.9 | v21.23,35.36 19.81,36.78 C2.1 | 30.28,31.9 v26.92,28.55 | 30.28,31.9 Y1.2
  Bottom 0.254: v37.9,27.53 38.81,26.62 39.12,26.62 IC2.7 | v21.23,35.36 21.23,34.24 v26.92,28.55
N$10  (via drill 0.3)
  Top 0.254: v44.3,32.82 41.25,32.82 40.03,31.6 35.36,31.6 34.34,32.61 R15.2
  Bottom 0.254: v44.3,32.82 44.3,30.28 46.63,27.94 46.94,27.94 47.85,27.03 48.77,27.03 T1.1
N$13
  Bottom 0.254: U$3.A 10.06,3.35 10.06,4.57 10.97,5.49 R12.1
N$14  (via drill 0.3)
  Top 0.254: C1.1 24.08,36.88 26.21,36.88 R14.1 26.42,36.88 28.14,38.61 33.63,38.61 v33.73,38.51 | 44.5,36.17 45.92,36.17 47.04,35.05 48.46,35.05 IC3.6 | 44.5,36.17 42.37,36.17 IC3.2 | v44.5,36.27 44.5,36.17
  Bottom 0.254: v33.73,38.51 43.89,38.51 44.5,37.9 v44.5,36.27
N$16  (via drill 0.3)
  Top 0.254: v45.52,34.65 43.99,34.65 43.69,34.95 42.37,34.95 IC3.3
  Bottom 0.254: v45.52,34.65 45.52,34.54 46.43,33.63 46.43,32.51 47.85,31.09 48.46,31.09 IC1.14
N$17  (via drill 0.3)
  Top 0.254: R14.2 28.25,36.88 30.38,36.88 R13.2 30.38,36.98 v31.39,38 | v43.89,37.59 45.11,37.59 46.43,36.27 48.46,36.27 IC3.7
  Bottom 0.254: v43.89,37.59 43.48,38 34.14,38 34.04,37.9 31.5,37.9 v31.39,38
N$20
  Top 0.254: R17.1 36.27,30.28 39.22,30.28 39.42,30.48 TOPS.OUT
N$21  (via drill 0.3)
  Top 0.254: C5.1 40.03,37.08 40.03,36.07 39.52,35.56 TOPS.VCC | v45.41,30.48 43.69,30.48 43.18,29.97 42.57,29.97 R19.2
  Bottom 0.254: v45.41,30.48 45.41,33.22 43.69,34.95 43.69,35.26 43.48,35.46 39.52,35.46 TOPS.VCC
N$23  (via drill 0.3)
  Top 0.254: R20.2 48.36,31.6 47.24,30.48 46.63,30.48 T3.3 46.94,30.38 v46.94,29.46
  Bottom 0.254: v46.94,29.46 47.14,29.67 48.46,29.67 IC1.15
N$29  (via drill 0.3)
  Top 0.254: v41.45,14.83 38.91,14.83 38.3,15.44 21.84,15.44 v20.32,16.97 | v13.82,23.98 12.29,25.5 10.97,25.5 10.36,26.11 9.14,26.11 6.5,28.75 R2.2 6.4,28.75 4.57,26.92 3.66,26.92 R1.1
  Bottom 0.254: v41.45,14.83 43.38,16.76 43.38,17.58 42.98,17.98 42.98,18.19 IC2.22 | v20.32,16.97 19.51,17.78 19.51,22.35 17.88,23.98 v13.82,23.98
N$33
  Bottom 0.254: T7.1 13.01,37.29 9.45,37.29 R26.2
N$34  (via drill 0.3)
  Top 0.254: v11.58,33.33 v13.01,34.75
  Bottom 0.254: v13.01,34.75 13.31,35.05 13.92,35.05 T7.3 | v11.58,33.33 11.58,31.09 11.48,30.99 BUZZER.P$1
NIRQ
  Bottom 0.254: IC2.1 35.66,23.27 35.46,23.27 34.14,24.59 33.33,24.59 U$7.NIRQ
RED  (via drill 0.3)
  Top 0.254: v15.95,10.67 36.68,10.67 38.3,12.29 39.62,12.29 40.54,11.38 v42.77,11.38 | v45.01,25.6 v45.01,16.76
  Bottom 0.254: v15.95,10.67 16.05,10.57 16.05,9.04 13.61,6.6 13.61,3.35 U$3.R | v42.77,11.38 45.01,13.61 v45.01,16.76 | v45.01,25.6 44.7,25.6 43.28,27.03 42.88,27.03 42.47,26.62 IC2.10
RESET  (via drill 0.3)
  Top 0.254: v38.2,20.22 39.12,20.22 43.18,16.15 43.18,15.44 | 43.18,15.44 43.18,13.41 45.41,11.18 v45.41,10.46 | 43.18,15.44 38.91,15.44 38.51,15.85 26.42,15.85 24.69,17.58 19.1,17.58 11.38,9.86 10.87,9.86 ISP.5
  Bottom 0.254: v38.2,20.22 37.49,19.51 IC2.29 | v45.41,10.46 46.43,9.45 R3.2 46.53,9.35 46.63,9.25 46.63,7.21 RESET.BOT-2
SCK  (via drill 0.3)
  Top 0.254: v26.92,24.79 26.92,24.18 24.59,21.84 22.05,21.84 18.19,17.98 v16.15,17.98 | v40.74,21.54 36.88,21.54 36.27,20.93 31.09,20.93 29.67,22.35 29.67,25.81 v30.07,26.21
  Bottom 0.254: v26.92,24.79 28.35,26.21 v30.07,26.21 30.99,26.21 31.9,27.13 33.22,27.13 U$7.SCLK | v16.15,17.98 15.54,18.59 14.43,18.59 U1.5 14.33,18.59 13.31,18.59 11.68,16.97 11.68,12.5 11.89,12.29 11.89,9.45 11.18,8.74 10.36,8.74 9.35,9.75 8.84,9.75 ISP.3 | v40.74,21.54 45.11,21.54 45.52,21.13 45.72,21.13 IC2.17
SCL  (via drill 0.3)
  Top 0.254: v38.81,19.61 36.47,19.61 35.56,20.52 30.68,20.52 30.48,20.32 29.87,20.32 27.53,22.66 27.53,25.09 24.69,27.94 24.59,27.94 23.57,28.96 23.57,33.12 23.47,33.22 13.21,33.22 12.09,32.11 10.46,32.11 9.55,31.19 v9.55,30.99 | v5.28,20.83 6.2,19.91 7.32,19.91 CN1.D+
  Bottom 0.254: v38.81,19.61 38.1,18.9 IC2.28 | v9.55,30.99 9.04,30.48 7.01,30.48 5.59,29.06 5.59,21.13 v5.28,20.83
SD-SELECT  (via drill 0.3)
  Top 0.254: v38.71,23.57 37.8,23.57 37.59,23.77 31.5,23.77 v30.38,22.66 | v24.28,22.45 19.3,22.45 v18.9,22.05
  Bottom 0.254: v38.71,23.57 43.59,23.57 44.3,24.28 44.6,24.28 IC2.14 | v30.38,22.66 25.4,22.66 25.2,22.45 v24.28,22.45 | v18.9,22.05 14.43,22.05 U1.2
SDA  (via drill 0.3)
  Top 0.254: v35.05,17.88 25.91,17.88 v22.96,20.83 | v19.41,24.38 19.41,25.91 19.1,26.21 13.21,26.21 13.11,26.11 v11.38,26.11 | v9.04,21.23 8.53,20.73 7.42,20.73 CN1.D-
  Bottom 0.254: v35.05,17.88 37.9,17.88 38.2,18.19 38.51,18.19 IC2.27 | v19.41,24.38 v22.96,20.83 | v11.38,26.11 11.38,23.98 9.04,21.64 v9.04,21.23
SEN-SELECT  (via drill 0.3)
  Top 0.254: v41.05,16.15 40.03,16.15 37.59,18.59 33.33,18.59 32,19.91 v31.39,19.91 | v30.18,20.93 30.18,21.23 29.26,22.15 29.26,26.31 31.09,28.14 v34.34,28.14
  Bottom 0.254: v41.05,16.15 42.16,16.15 42.77,16.76 42.77,17.07 42.47,17.37 42.47,17.68 IC2.23 | v31.39,19.91 30.38,20.93 v30.18,20.93 | v34.34,28.14 34.34,32.82 35.87,34.34 R16.1
SW  (via drill 0.3)
  Top 0.254: v9.35,28.25 10.36,27.23 R6.2 | v5.69,19.51 6.1,19.1 7.32,19.1 CN1.ID
  Bottom 0.254: 8.64,28.45 9.35,28.45 | 9.35,28.45 9.96,28.45 13.41,24.99 19.71,24.99 20.52,24.18 27.23,24.18 28.04,24.99 30.58,24.99 30.89,24.69 30.89,23.06 32.82,21.13 35.66,21.13 IC2.32 | 8.64,28.45 7.72,29.36 T2.2 | v9.35,28.25 9.35,28.45 | v5.69,19.51 5.69,20.32 8.13,22.76 8.13,27.84 8.64,28.35 8.64,28.45
V-LX  (via drill 0.3)
  Top 0.254: v12.29,12.8 10.87,14.22 L1.2
  Bottom 0.254: D1.A 8.33,7.21 7.62,6.5 7.62,5.18 BL8530.3 7.62,4.98 7.62,4.27 9.35,2.54 10.67,2.54 12.29,4.17 v12.29,12.8
VBAT
  Top 0.254: SWITCH.2 2.23,6.71 3.66,6.71 4.98,8.03 13.82,8.03 15.14,9.35 BATTERY.3V3